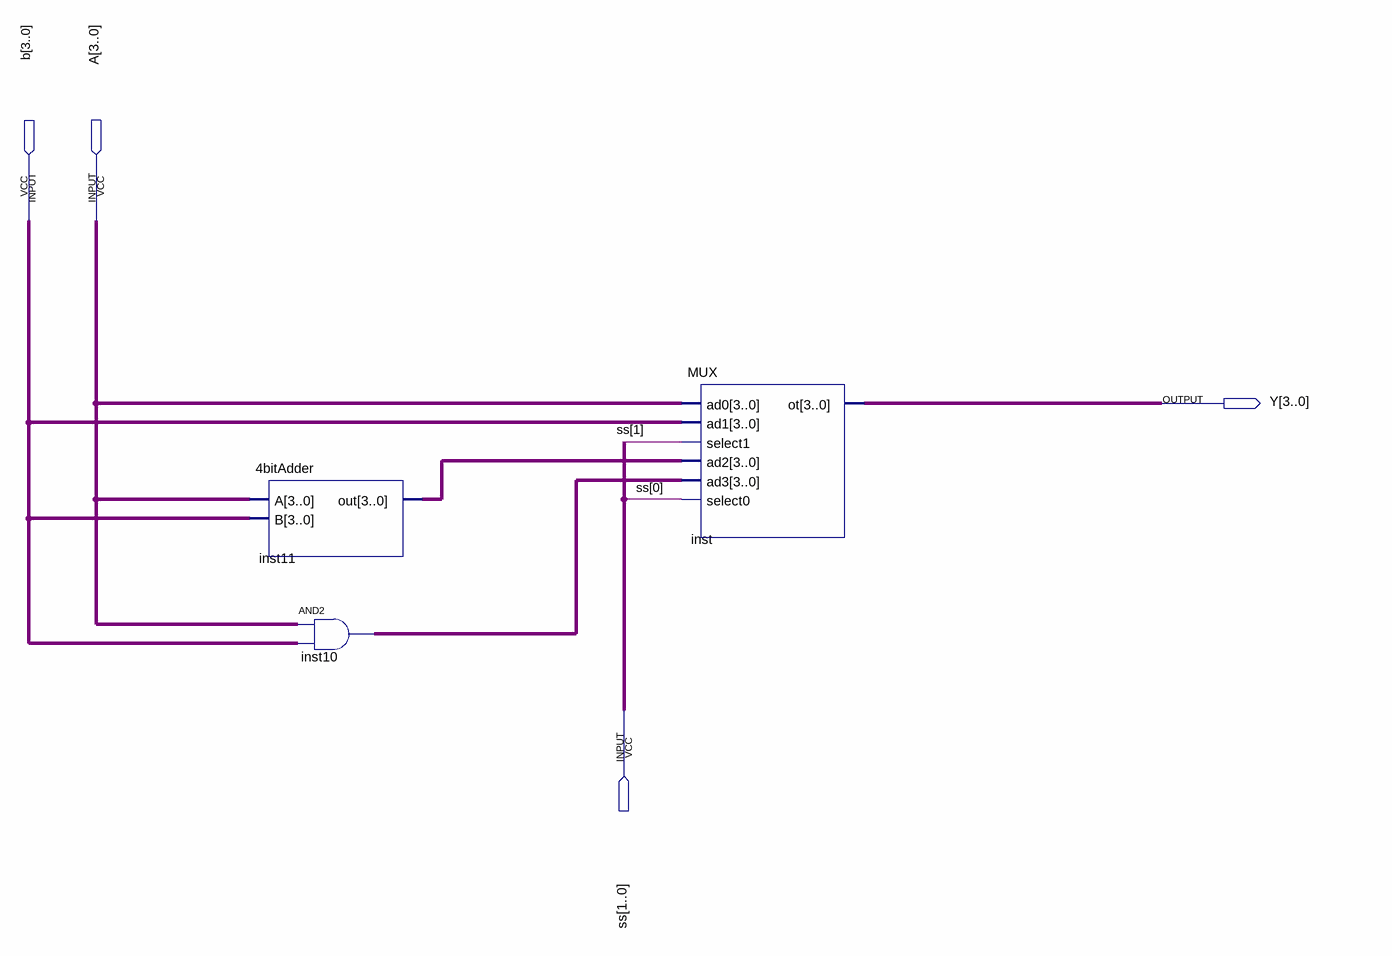
[diagram p0: schematic sheet]
// Quartus schematic alu.bdf as structural Verilog: 3 symbols, 4 pins
module alu (
  input  [3:0] b,
  input  [3:0] A,
  input  [1:0] ss,
  output [3:0] Y
);

  wire [3:0] inst10_out, inst11_out;

  \4bitAdder  inst11 (.A(A), .B(b), .out(inst11_out));
  assign inst10_out = A & b;  // AND2 inst10, 4 bits wide
  MUX inst (.ad0(A), .ad1(b), .select1(ss[1]), .ad2(inst11_out), .ad3(inst10_out), .select0(ss[0]), .ot(Y));
endmodule
